# Altium schematic sheet Sch_connectors.SchDoc
size A
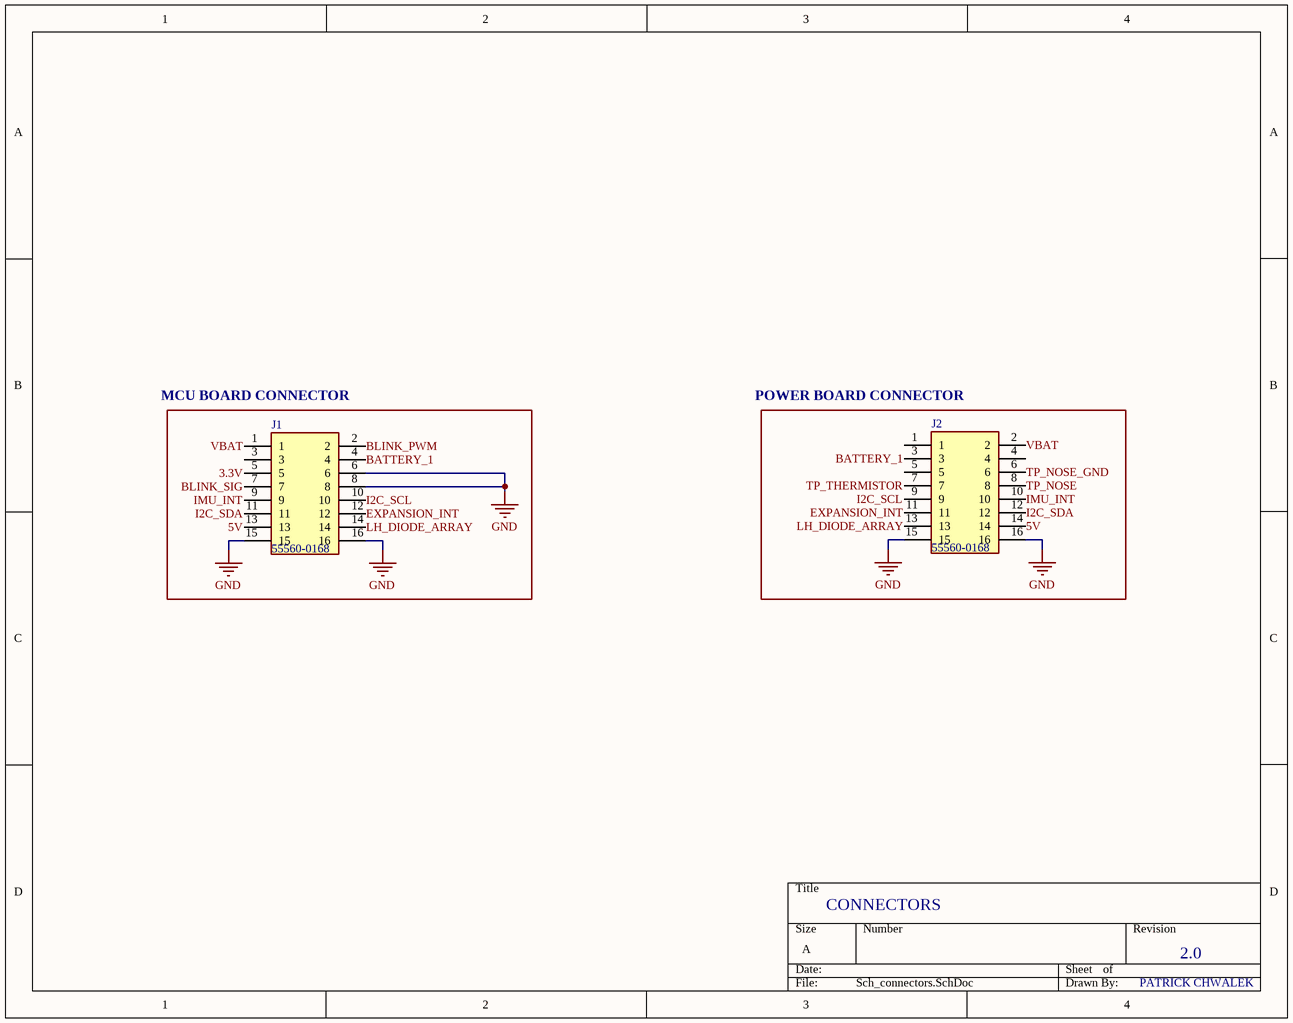
[diagram p0: Sch_connectors.SchDoc]

## Parts
J1  55560-0168  [555600168]
J2  55560-0168  [555600168]

## Nets
GND: J1.6 J1.8 J1.15 J1.16 J2.15 J2.16
3.3V: J1.5
5V: J1.13 J2.14
BATTERY_1: J1.4 J2.3
BLINK_PWM: J1.2
BLINK_SIG: J1.7
EXPANSION_INT: J1.12 J2.11
I2C_SCL: J1.10 J2.9
I2C_SDA: J1.11 J2.12
IMU_INT: J1.9 J2.10
LH_DIODE_ARRAY: J1.14 J2.13
TP_NOSE: J2.8
TP_NOSE_GND: J2.6
TP_THERMISTOR: J2.7
VBAT: J1.1 J2.2

Not connected (* = marked no-connect by the designer): J1 3; J2 1 4 5

## Notes on the sheet
- (near J1) MCU BOARD CONNECTOR
- (near J2) POWER BOARD CONNECTOR
- CONNECTORS
- 2.0
- PATRICK CHWALEK

## Library data of the parts
J1 J2 = 55560-0168: Connector; Manufacturer_Name: Molex; Allied_Number: 70374726; Datasheet Link: https://www.molex.com/pdm_docs/sd/555600168_sd.pdf; Height: 1.15mm; Manufacturer_Part_Number: 55560-0168; Mouser Part Number: 538-55560-0168; Mouser Price/Stock: https://www.mouser.com/Search/Refine.aspx?Keyword=538-55560-0168; RS Part Number: 7206558P; RS Price/Stock: http://uk.rs-online.com/web/p/products/7206558P; Allied Price/Stock: https://www.alliedelec.com/molexincorporated-55560-0168/70374726/